# EAGLE design DDL_demo_board (EAGLE 7.3.0)
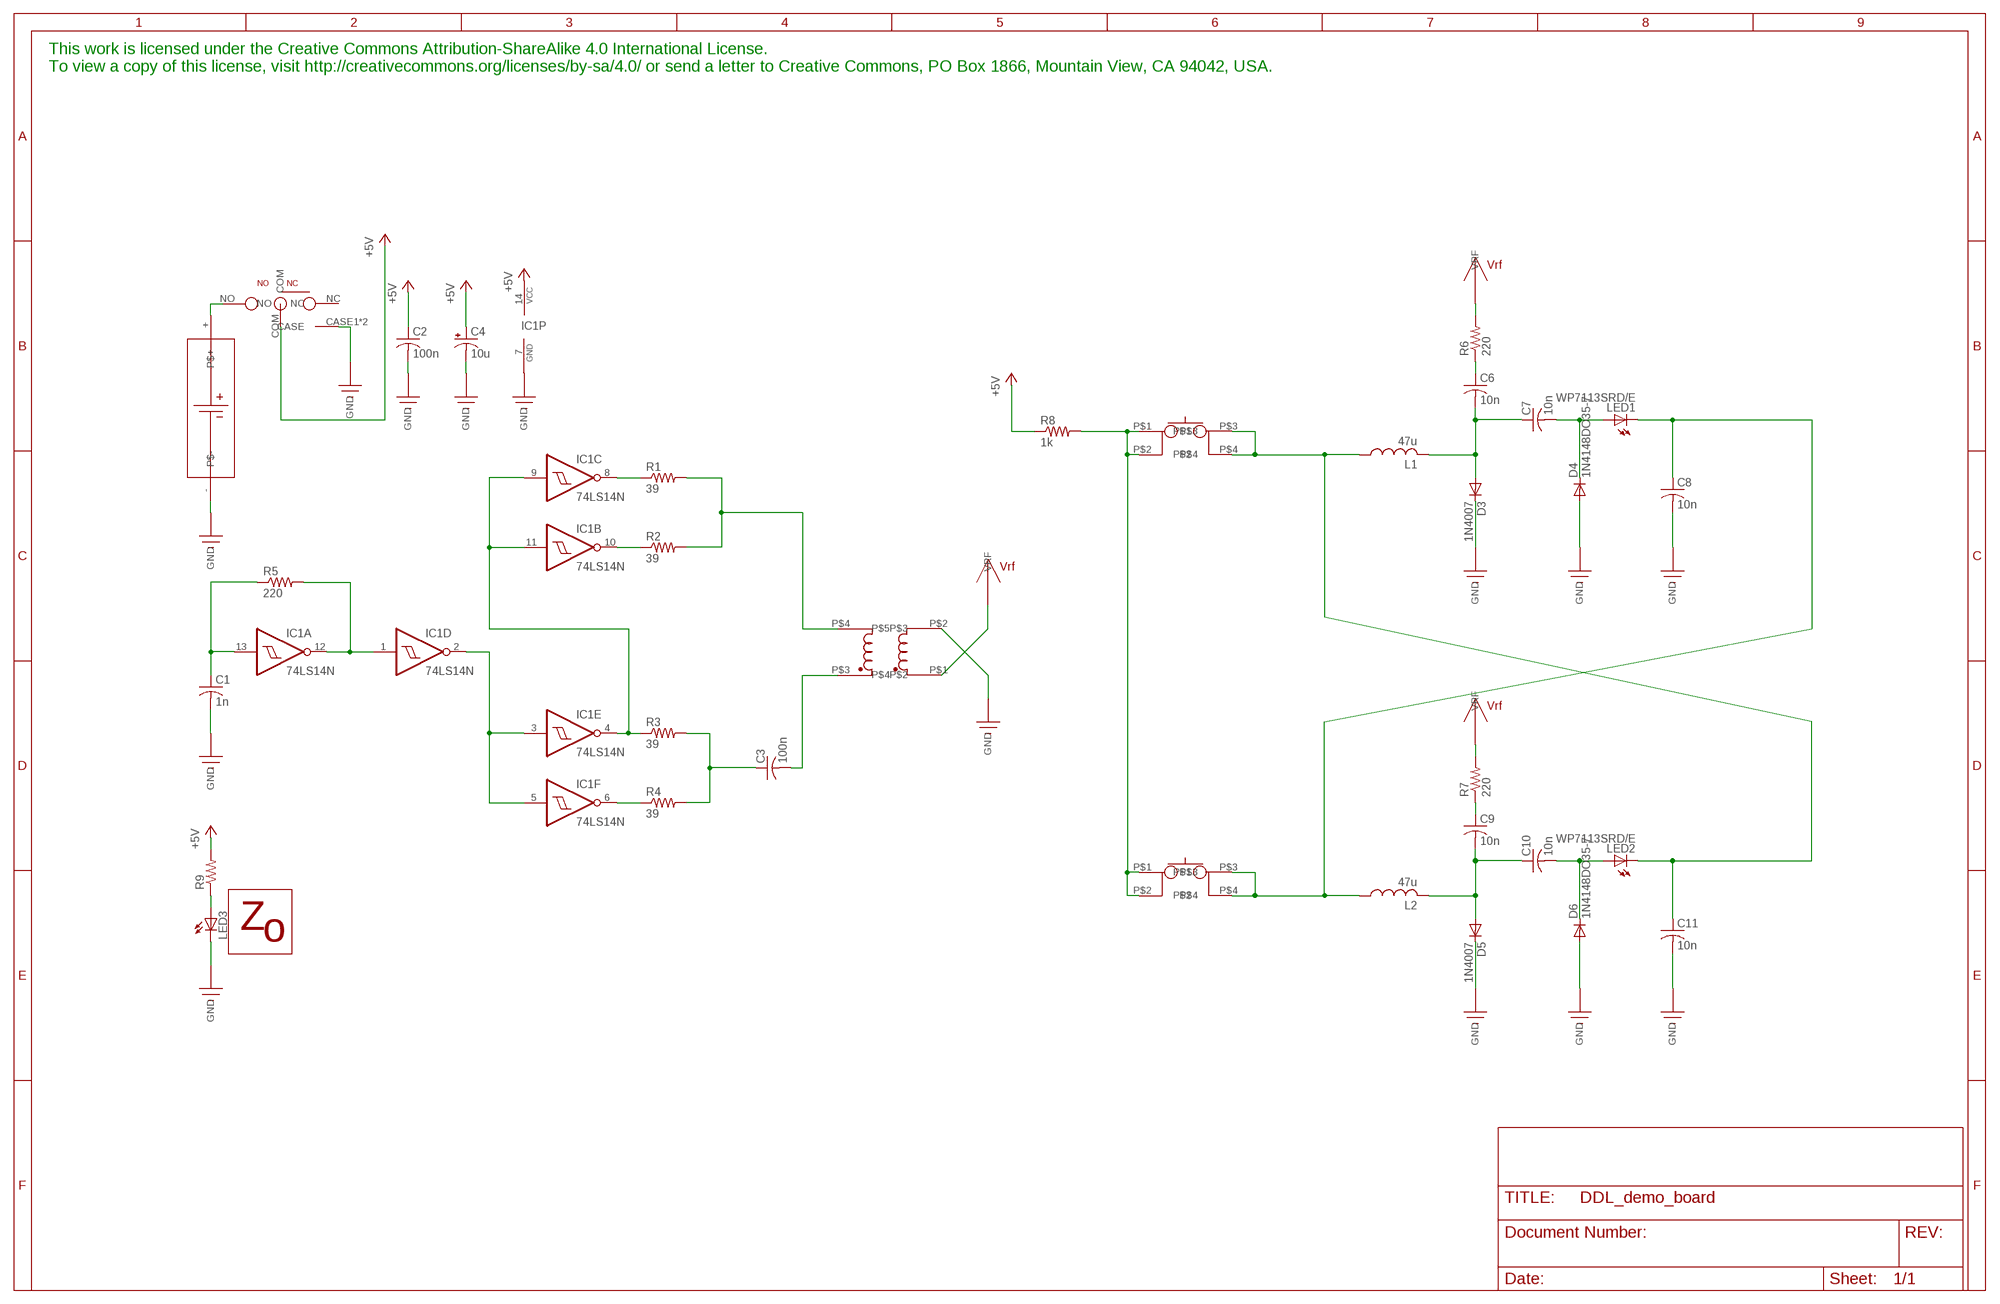
[diagram p0: schematic, sheet 1]

## Parts
C1  1n  C-US025-025X050  [C025-025X050]
C2  100n  C-US050-025X075  [C050-025X075]
C3  100n  C-US050-025X075  [C050-025X075]
C4  10u  CPOL-USE2.5-6  [E2,5-6]
C6  10n  C-US025-025X050  [C025-025X050]
C7  10n  C-US025-025X050  [C025-025X050]
C8  10n  C-US025-025X050  [C025-025X050]
C9  10n  C-US025-025X050  [C025-025X050]
C10  10n  C-US025-025X050  [C025-025X050]
C11  10n  C-US025-025X050  [C025-025X050]
D3  1N4007  [DO41-10]
D4  1N4148DO35-7  [DO35-7]
D5  1N4007  [DO41-10]
D6  1N4148DO35-7  [DO35-7]
IC1  74LS14N  [DIL14]
L1  47u  L-US0207/10  [0207/10]
L2  47u  L-US0207/10  [0207/10]
LED1  WP7113SRD/E  LED5MM  [LED5MM]
LED2  WP7113SRD/E  LED5MM  [LED5MM]
LED3  LEDP-LCC-2-BACK  [P-LCC-2-TOPLED-RG]
R1  39  R-US_0207/10  [0207/10]
R2  39  R-US_0207/10  [0207/10]
R3  39  R-US_0207/10  [0207/10]
R4  39  R-US_0207/10  [0207/10]
R5  220  R-US_0207/10  [0207/10]
R6  220  R-US_0207/10  [0207/10]
R7  220  R-US_0207/10  [0207/10]
R8  1k  R-US_0207/10  [0207/10]
R9  R-US_R0805  [R0805]
U$1  Z0_LOGO200MIL_NS  [Z0_LOGO_200_MIL_NO_SILK]
U$2  OS1020_SPDT  [OS1020_SWITCH]
U$10  PCB_MOM_SPST_SWITCH  [SWITCH_PCB_MOM]
U$11  PCB_MOM_SPST_SWITCH  [SWITCH_PCB_MOM]
U$12  FT37_BIFILAR_1  [FT37_BIFILAR_VERT2]
U$16  4AA_BATT_HOLDERNO_HOLES  [4AA_BATT_PACK_NO_HOLES]

## Nets
+5V: C2.1 C4.+ IC1.14(P:VCC) R8.1 R9.2 U$2.COM
GND: C1.2 C2.2 C4.- C8.2 C11.2 D3.C D4.A D5.C D6.A IC1.7(P:GND) LED3.C U$2.CASE1(CASE) U$2.CASE2(CASE) U$12.P$2 U$16.-(P$-)
N$1: C3.2 U$12.P$3
N$2: C7.2 D4.C LED1.A
N$3: C1.1 IC1.13(A:I) R5.1
N$4: IC1.2(D:O) IC1.3(E:I) IC1.5(F:I)
N$5: IC1.4(E:O) IC1.9(C:I) IC1.11(B:I) R3.1
N$6: C6.1 R6.1
N$7: IC1.8(C:O) R1.1
N$8: IC1.10(B:O) R2.1
N$9: LED3.A R9.1
N$10: IC1.6(F:O) R4.1
N$11: C6.2 C7.1 D3.A L1.2
N$12: U$2.NO U$16.+(P$+)
N$14: C3.1 R3.2 R4.2
N$15: R1.2 R2.2 U$12.P$4
N$16: C9.1 R7.1
N$18: C9.2 C10.1 D5.A L2.2
N$19: C10.2 D6.C LED2.A
N$22: C11.1 L1.1 LED2.K(C) U$10.P$3 U$10.P$4
N$23: IC1.1(D:I) IC1.12(A:O) R5.2
N$24: C8.1 L2.1 LED1.K(C) U$11.P$3 U$11.P$4
N$27: R8.2 U$10.P$1 U$10.P$2 U$11.P$1 U$11.P$2
VRF: R6.2 R7.2 U$12.P$1 ; supply symbol labelled V_RF
Unconnected: U$2.NC

## Notes on the sheet
- This work is licensed under the Creative Commons Attribution-ShareAlike 4.0 International License. 
  To view a copy of this license, visit http://creativecommons.org/licenses/by-sa/4.0/ or send a letter to Creative Commons, PO Box 1866, Mountain View, CA 94042, USA.

## Library data of the parts
C1-C3 C6-C11 = z0:C-US: CAPACITOR, American symbol
C4 = rcl:CPOL-US: POLARIZED CAPACITOR, American symbol
D3 D5 = z0:1N4007: DIODE general purpose rectifier, 1 A
D4 D6 = z0:1N4148: DIODE high speed (Philips)
IC1 = 74xx-us:74*14: Hex schmitt trigger INVERTER
L1 L2 = z0:L-US: INDUCTOR, American symbol
LED1-LED3 = z0:LED: LED OSRAM: - CHIPLED LG R971, LG N971, LY N971, LG Q971, LY Q971, LO R971, LY R971 LH N974, LH R974 LS Q976, LO Q976, LY Q976 LO Q996 - Hyper CHIPLED LW Q18S LB Q993, LB Q99A, LB R99A - SideLED LS A670, LO A670, LY A670, LG A670, LP A670 LB A673, LV A673, LT A673, LW A673 LH A674 LY A675 LS A676, LA A676, LO A676, LY A676, LW A676 LS A679, LY A679, LG A679 - Hyper Micro SIDELED® LS Y876, LA Y876, LO Y876, LY Y876 LT Y87S - SmartLED LW L88C, LW L88S LB L89C, LB L89S, LG L890 LS L89K, LO L89K, LY L89K LS L896, LA L896, LO L896, LY L896 - TOPLED LS T670, LO T670, LY T670, LG T670, LP T670 LSG T670, LSP T670, LSY T670, LOP T670, LYG T670 LG T671, LOG T671, LSG T671 LB T673, LV T673, LT T673, LW T673 LH T674 LS T676, LA T676, LO T676, LY T676, LB T676, LH T676, LSB T676, LW T676 LB T67C, LV T67C, LT T67C, LS T67K, LO T67K, LY T67K, LW E67C LS E67B, LA E67B, LO E67B, LY E67B, LB E67C, LV E67C, LT E67C LW T67C LS T679, LY T679, LG T679 LS T770, LO T770, LY T770, LG T770, LP T770 LB T773, LV T773, LT T773, LW T773 LH T774 LS E675, LA E675, LY E675, LS T675 LS T776, LA T776, LO T776, LY T776, LB T776 LHGB T686 LT T68C, LB T68C - Hyper Mini TOPLED® LB M676 - Mini TOPLED Santana® LG M470 LS M47K, LO M47K, LY M47K Source: http://www.osram.convergy.de LUXEON: - LUMILED® LXK2-PW12-R00, LXK2-PW12-S00, LXK2-PW14-U00, LXK2-PW14-V00 LXK2-PM12-R00, LXK2-PM12-S00, LXK2-PM14-U00 LXK2-PE12-Q00, LXK2-PE12-R00, LXK2-PE12-S00, LXK2-PE14-T00, LXK2-PE14-U00 LXK2-PB12-K00, LXK2-PB12-L00, LXK2-PB12-M00, LXK2-PB14-N00, LXK2-PB14-P00, LXK2-PB14-Q00 LXK2-PR12-L00, LXK2-PR12-M00, LXK2-PR14-Q00, LXK2-PR14-R00 LXK2-PD12-Q00, LXK2-PD12-R00, LXK2-PD12-S00 LXK2-PH12-R00, LXK2-PH12-S00 LXK2-PL12-P00, LXK2-PL12-Q00, LXK2-PL12-R00 Source: www.luxeon.com KINGBRIGHT: KA-3528ASYC Source: www.kingbright.com
R1-R9 = z0:R-US_: RESISTOR, American symbol
U$1 = z0:Z0_LOGO
U$2 = z0:OS1020_SPDT
U$10 U$11 = z0:PCB_MOM_SPST_SWITCH
U$12 = z0:FT37_BIFILAR_1
U$16 = z0:4AA_BATT_HOLDER

## Board
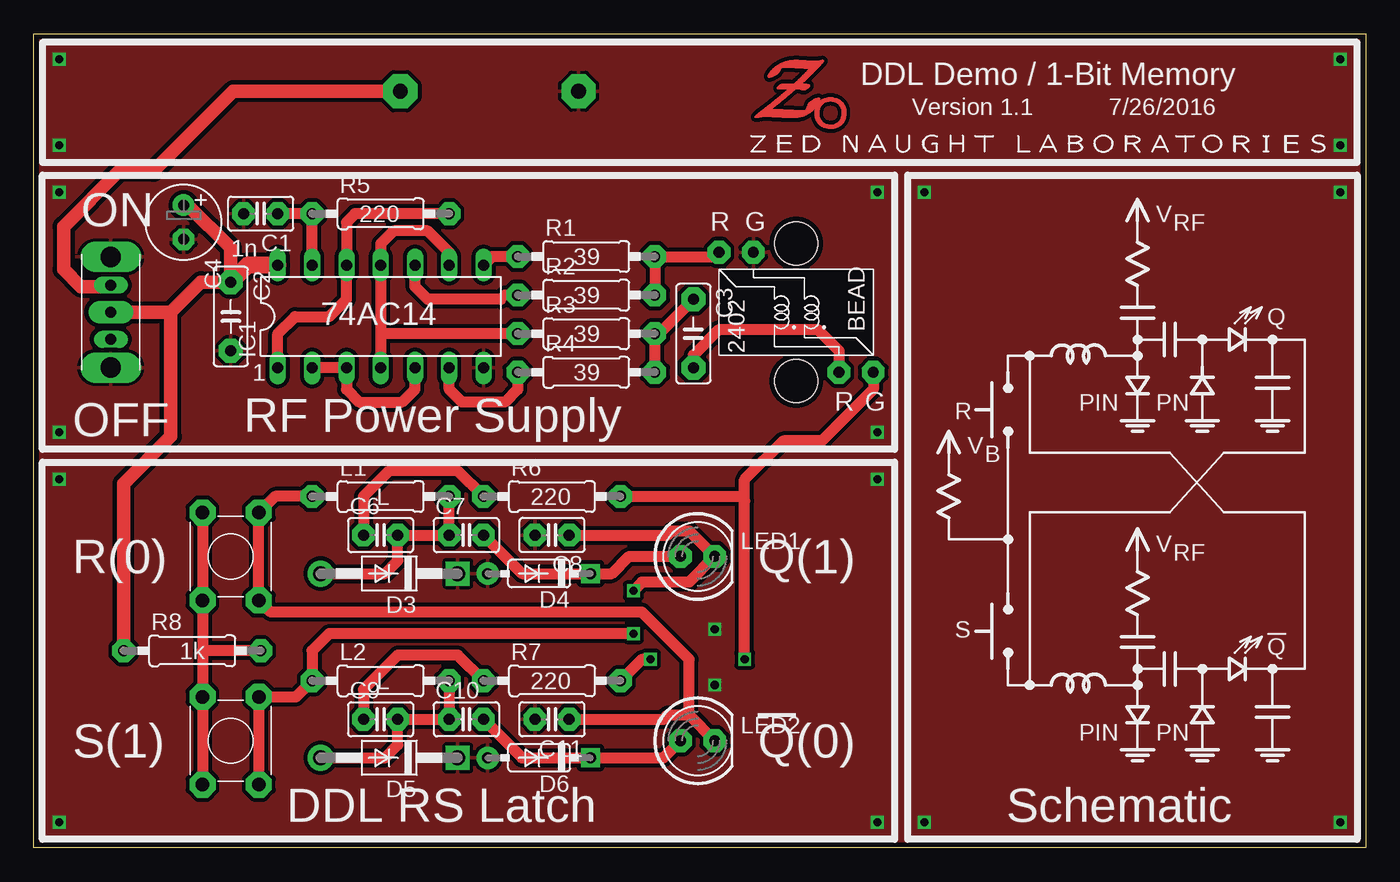
[diagram p1: board, top side]
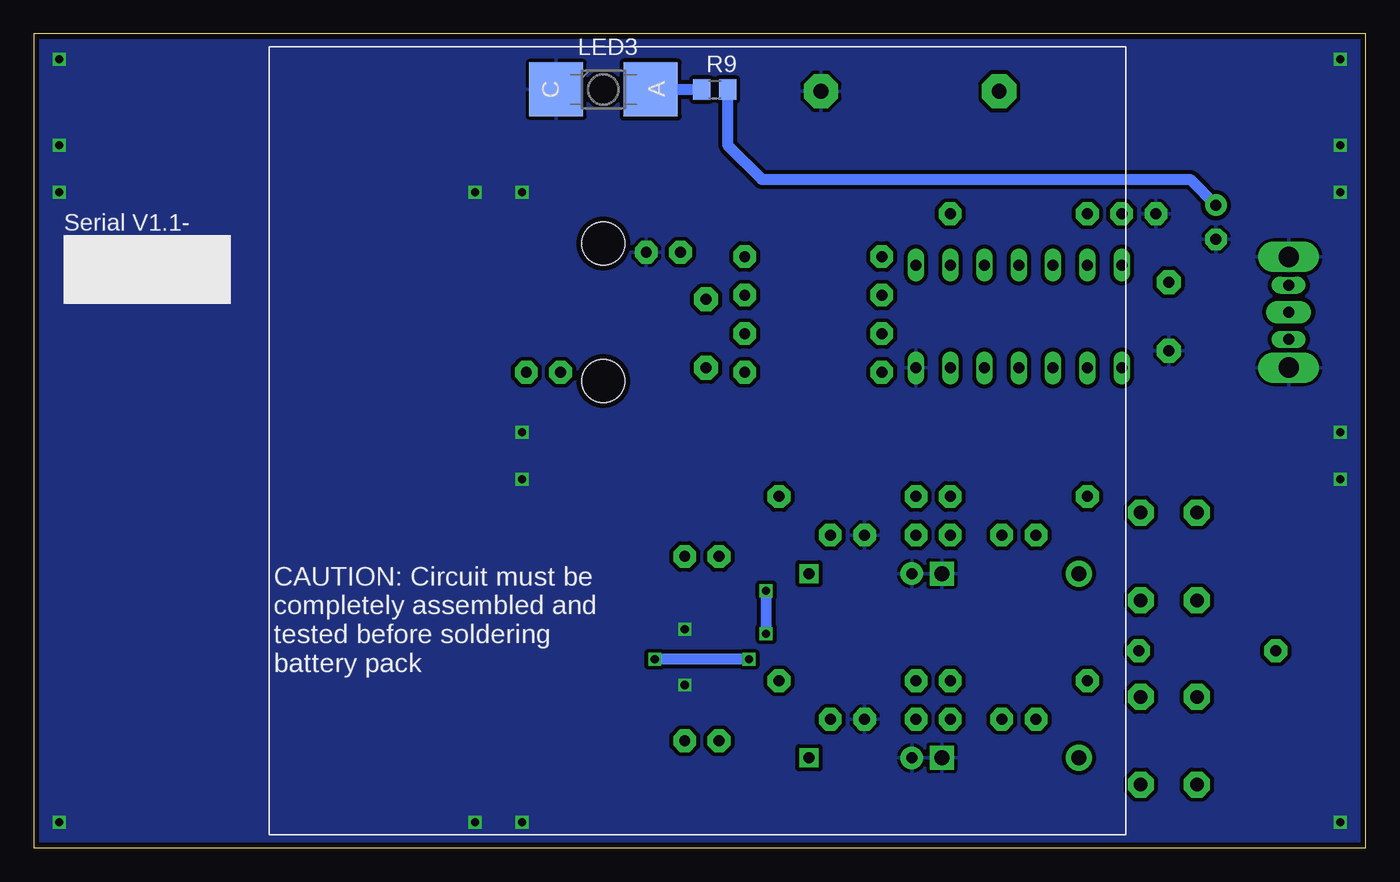
[diagram p2: board, bottom side, seen from below]

Size 98.74 x 60.33 mm. Coordinates in mm from the lower left corner, seen from the top.
Outline: 0,0 0,60.33 98.74,60.33 98.74,0 0,0
Copper layers (1*16): Top 0.0356mm / dielectric 1.5011mm / Bottom 0.0356mm
Design rules "LaenPCBOrder_tented_vias_12mil": minimum track width 8mil, minimum drill 13mil, track to track 12mil, track to pad 12mil, pad to pad 12mil, via to via 12mil, smd to smd 12mil, copper to edge 15mil, drill to drill 6mil, minimum pad ring 7mil, minimum via ring 7mil, stop-mask expansion 4mil, vias tented up to drill 28mil, thermal gap 10mil

### Footprints (pad centres in the part's own frame; a part is rotated, then mirrored left to right if it is on the bottom)
C025-025X050 = drill 0.813 pad 1.676 octagon: 1 -1.27,0; 2 1.27,0
C050-025X075 = drill 0.813 pad 1.778 octagon: 1 -2.54,0; 2 2.54,0
E2,5-6 = drill 0.813 pad 1.6: + -1.27,0 | drill 0.813 pad 1.6 octagon: - 1.27,0
DO41-10 = drill 1.118 pad 1.93: A 5.08,0 | drill 1.118 pad 1.778 square: C -5.08,0
DO35-7 = drill 0.813 pad 1.676: A 3.81,0 | drill 0.813 pad 1.422 square: C -3.81,0
DIL14 = drill 0.813 long: 1 -7.62,-3.81; 2 -5.08,-3.81; 3 -2.54,-3.81; 4 0,-3.81; 5 2.54,-3.81; 6 5.08,-3.81; 7 7.62,-3.81; 8 7.62,3.81; 9 5.08,3.81; 10 2.54,3.81; 11 0,3.81; 12 -2.54,3.81; 13 -5.08,3.81; 14 -7.62,3.81
0207/10 = drill 0.813 pad 1.676 octagon: 1 -5.08,0; 2 5.08,0
LED5MM = drill 0.813 pad 1.676 octagon: A -1.27,0; K 1.27,0
P-LCC-2-TOPLED-RG = smd 4 x 4: A 0,3.5; C 0,-3.5
R0805 = smd 1.3 x 1.5: 1 -0.95,0; 2 0.95,0
OS1020_SWITCH = drill 1.5 pad 2.032 long: CASE1 -4.102,0; CASE2 4.102,0 | drill 0.8 pad 1.676 long: COM 0,0 | drill 0.8 pad 1.27 long: NC -2.007,0; NO 2.007,0
SWITCH_PCB_MOM = drill 1 pad 1.93 octagon: P$1 -2.083,3.251; P$2 -2.083,-3.251; P$3 2.083,3.251; P$4 2.083,-3.251
FT37_BIFILAR_VERT2 = drill 0.8 pad 1.676 octagon: P$1 -4.445,-5.715; P$2 4.445,3.175; P$3 -4.445,-3.175; P$4 4.445,5.715 | hole 3.2: -5.08,0; 5.08,0
4AA_BATT_PACK_NO_HOLES = drill 1.1 pad 2.54 octagon: + 22.352,25.908; - 9.144,25.908

### Placement (x,y rotation side)
C1  16.83,46.99 180 top
C2  14.61,39.37 270 top
C3  48.9,38.1 270 top
C4  11.11,46.35 270 top
C6  25.72,23.18 0 top
C7  32.07,23.18 0 top
C8  38.42,23.18 180 top
C9  25.72,9.53 0 top
C10  32.07,9.53 0 top
C11  38.42,9.53 180 top
D3  26.35,20.32 180 top
D4  37.47,20.32 180 top
D5  26.35,6.67 180 top
D6  37.47,6.67 180 top
IC1  25.72,39.37 0 top
L1  25.72,26.04 0 top
L2  25.72,12.38 0 top
LED1  49.21,21.59 0 top
LED2  49.21,7.94 0 top
LED3  56.52,56.2 270 bottom
R1  40.96,43.81 0 top
R2  40.96,40.96 0 top
R3  40.96,38.1 0 top
R4  40.96,35.24 0 top
R5  25.72,46.99 0 top
R6  38.42,26.04 0 top
R7  38.42,12.38 0 top
R8  11.75,14.61 0 top
R9  48.26,56.2 0 bottom
U$1  56.52,56.2 0 top
U$2  5.71,39.69 90 top
U$10  14.61,21.59 0 top
U$11  14.61,7.94 0 top
U$12  56.52,39.69 90 top
U$16  49.53,30.16 0 bottom

### Tracks (layer width: path | path; a pad name or v marks a point on that pad's centre or on a via)
+5V
  Top 1.016: U$2.COM 10.16,39.69 | 10.16,39.69 12.38,41.91 C2.1 14.61,44.45 11.43,47.62 C4.+ | R8.1 6.67,26.99 10.16,30.48 10.16,39.69
  Top 1.27: IC1.14 15.88,43.18 C2.1
  Bottom 0.813: R9.2 47.31,52.07 44.77,49.53 13.02,49.53 C4.+
GND  (via drill 0.6)
  other vias: 1.91,27.3 1.91,1.91 62.55,27.3 62.55,1.91 1.91,30.8 62.55,48.58 1.91,48.58 66.04,48.58 96.84,48.58 96.84,1.91 66.04,1.91 96.84,52.07 96.84,58.42 1.91,58.42 1.91,52.07 62.55,30.8 50.48,16.19 50.48,12.06
  pour Bottom: 0,60.33 98.74,60.33 98.74,0 0,0
  pour Top: 0,0 0,60.33 98.74,60.33 98.74,0
  pour Top (rank 3, no thermals): 52.07,59.69 52.07,52.7 61.59,52.7 61.59,59.69
N$1
  Top 0.813: C3.2 48.9,36.51 50.8,38.42 58.1,38.42 59.69,36.83 U$12.P$3
N$2
  Top 0.813: C7.2 36.2,20.32 D4.C 42.86,20.32 44.13,21.59 LED1.A
N$3
  Top 0.813: IC1.13 R5.1 C1.1
N$4
  Top 0.813: IC1.2 IC1.3 23.18,33.97 24.13,33.02 27.3,33.02 28.26,33.97 IC1.5
N$5
  Top 0.813: IC1.9 30.8,44.13 29.21,45.72 26.67,45.72 25.72,44.77 IC1.11 25.72,38.1 | 25.72,38.1 IC1.4 | R3.1 25.72,38.1
N$6
  Top 0.813: R6.1 31.43,27.94 26.35,27.94 24.45,26.04 C6.1
N$7
  Top 0.813: R1.1 33.97,43.81 IC1.8
N$8
  Top 0.813: R2.1 34.92,40.96 34.61,40.64 29.21,40.64 28.26,41.59 IC1.10
N$9
  Bottom 0.813: LED3.A R9.1
N$10
  Top 0.813: R4.1 35.88,33.97 34.92,33.02 31.75,33.02 30.8,33.97 IC1.6
N$11
  Top 0.813: L1.2 C7.1 C6.2 26.99,21.27 26.04,20.32 D3.A
N$12
  Top 1.016: U$16.+ 14.8,56.07 8.89,50.16 6.35,50.16 2.22,46.04 2.22,42.86 3.49,41.59 5.61,41.59 U$2.NO
N$14
  Top 0.813: R4.2 R3.2 46.35,38.1 C3.1
N$15
  Top 0.813: R2.2 R1.2 50.48,43.81 U$12.P$4
N$16
  Top 0.813: R7.1 31.43,14.29 26.99,14.29 24.45,11.75 C9.1
N$18
  Top 0.813: D5.A 26.04,6.67 26.99,7.62 C9.2 C10.1 L2.2
N$19
  Top 0.813: C10.2 36.2,6.67 D6.C 46.67,6.67 LED2.A
N$22
  Top 0.813: 48.58,9.84 48.58,13.97 45.09,17.46 17.56,17.46 U$10.P$4 U$10.P$3 17.88,26.04 L1.1 | C11.1 46.67,9.53 46.99,9.84 48.58,9.84 | 48.58,9.84 LED2.K
N$23
  Top 0.813: IC1.1 18.1,38.1 19.37,39.37 21.91,39.37 23.18,40.64 IC1.12 23.18,46.35 23.81,46.99 R5.2
N$24  (via drill 0.6)
  Top 0.813: U$11.P$4 U$11.P$3 19.44,11.19 L2.1 20.64,14.61 21.91,15.88 v44.45,15.88 | v44.45,19.05 45.09,19.68 48.58,19.68 LED1.K 48.58,23.5 47.31,23.5 46.99,23.18 C8.1
  Bottom 0.813: v44.45,19.05 v44.45,15.88
N$27
  Top 0.813: U$11.P$2 U$11.P$1 12.52,14.61 | U$10.P$1 U$10.P$2 12.52,14.61 | R8.2 12.52,14.61
VRF  (via drill 0.6)
  Top 0.813: v52.7,13.97 52.7,25.72 | 52.7,25.72 52.7,27.3 55.56,30.16 58.42,30.16 62.23,33.97 U$12.P$1 | R6.2 52.39,26.04 52.7,25.72 | v45.72,13.97 45.09,13.97 R7.2
  Bottom 0.813: v45.72,13.97 v52.7,13.97

### Text on the board
tPlace: DDL Demo / 1-Bit Memory | Version 1.1 | 7/26/2016 | ON | 220 | R | G | V | RF | 1n | 39 | 39 | 74AC14 | Q | 39 | 1 | 39 | R | G | R | PIN | PN | RF Power Supply | OFF | V | B | L | 220 | V | RF | R(0) | Q(1) | S | 1k | !Q! | L | 220 | PIN | PN | S(1) | !Q!(0) | DDL RS Latch | Schematic
bPlace: Serial V1.1- | CAUTION: Circuit must be / completely assembled and / tested before soldering / battery pack
Document: This work is licensed under the Creative Commons Attribution-ShareAlike 4.0 International License. / To view a copy of this license, visit http://creativecommons.org/licenses/by-sa/4.0/ or send a letter to Creative Commons, PO Box 1866, Mountain View, CA 94042, USA.